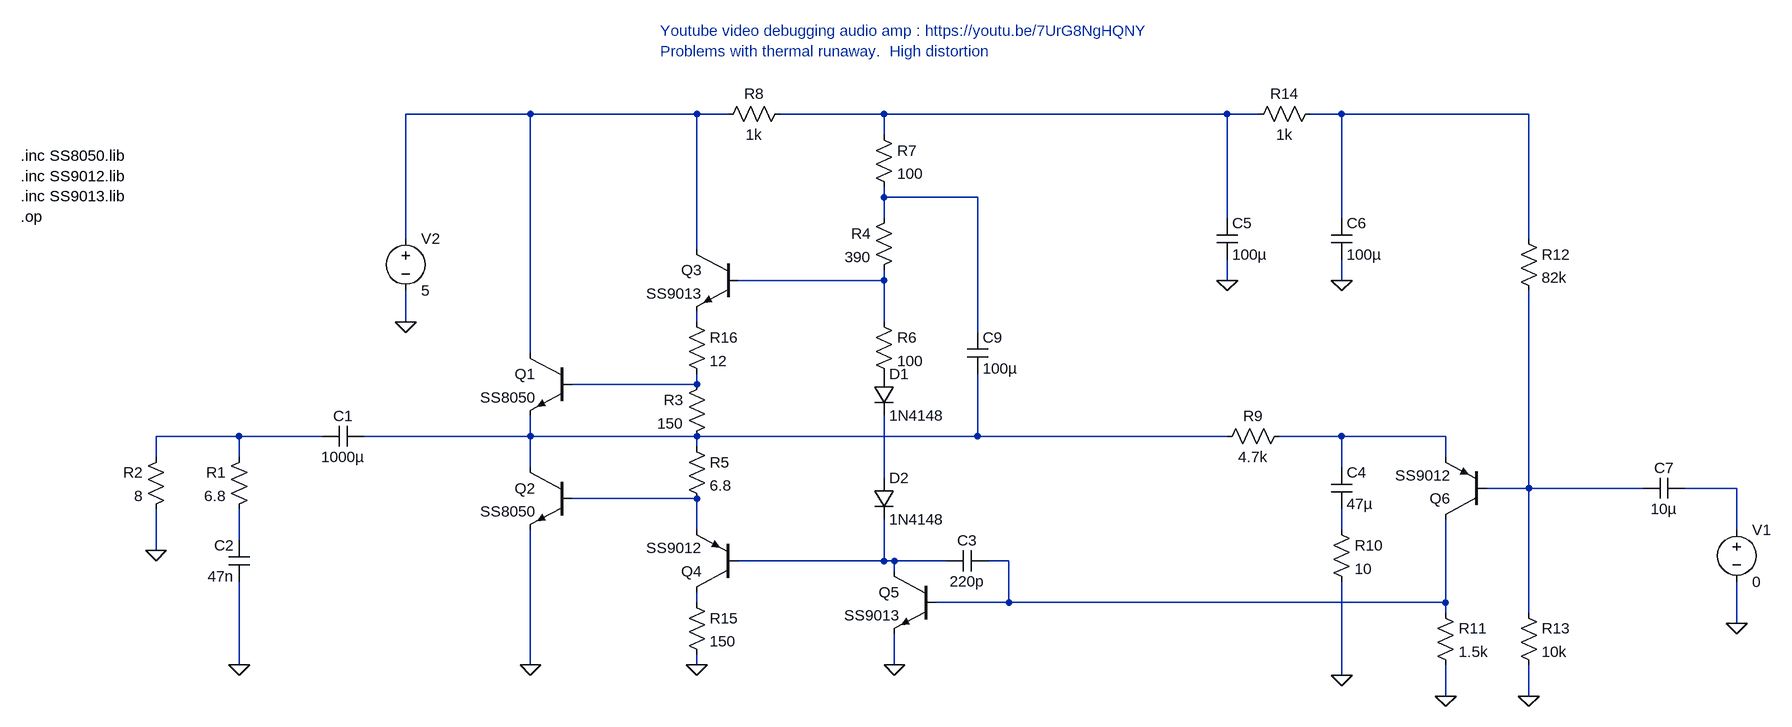
[diagram p0: schematic XTD-audio_amp.asc]
XTD-audio_amp.asc, the LTspice schematic file:
Version 4
SHEET 1 2280 680
WIRE 368 -336 176 -336
WIRE 624 -336 368 -336
WIRE 672 -336 624 -336
WIRE 912 -336 752 -336
WIRE 1440 -336 912 -336
WIRE 1488 -336 1440 -336
WIRE 1616 -336 1568 -336
WIRE 1904 -336 1616 -336
WIRE 912 -304 912 -336
WIRE 912 -208 912 -224
WIRE 1056 -208 912 -208
WIRE 912 -176 912 -208
WIRE 1440 -176 1440 -336
WIRE 1616 -176 1616 -336
WIRE 176 -144 176 -336
WIRE 1904 -144 1904 -336
WIRE 624 -128 624 -336
WIRE 912 -80 912 -96
WIRE 912 -80 688 -80
WIRE 1440 -80 1440 -112
WIRE 1616 -80 1616 -112
WIRE 176 -16 176 -64
WIRE 624 -16 624 -32
WIRE 912 -16 912 -80
WIRE 1056 0 1056 -208
WIRE 368 32 368 -336
WIRE 624 80 624 64
WIRE 624 80 432 80
WIRE -80 160 -208 160
WIRE 48 160 -80 160
WIRE 368 160 368 128
WIRE 368 160 112 160
WIRE 624 160 368 160
WIRE 1056 160 1056 64
WIRE 1056 160 624 160
WIRE 1440 160 1056 160
WIRE 1616 160 1520 160
WIRE 1776 160 1616 160
WIRE 624 176 624 160
WIRE -208 192 -208 160
WIRE -80 192 -80 160
WIRE 1776 192 1776 160
WIRE 368 208 368 160
WIRE 1616 208 1616 160
WIRE 912 224 912 128
WIRE 1904 240 1904 -64
WIRE 1904 240 1840 240
WIRE 2080 240 1904 240
WIRE 2224 240 2144 240
WIRE 624 256 432 256
WIRE 624 304 624 256
WIRE 1616 304 1616 272
WIRE 2224 304 2224 240
WIRE -80 320 -80 272
WIRE -208 336 -208 272
WIRE 912 352 912 288
WIRE 912 352 688 352
WIRE 928 352 912 352
WIRE 1008 352 928 352
WIRE 1104 352 1072 352
WIRE 928 368 928 352
WIRE 624 416 624 400
WIRE 1104 416 1104 352
WIRE 1104 416 992 416
WIRE 1776 416 1776 288
WIRE 1776 416 1104 416
WIRE 1776 432 1776 416
WIRE 1904 432 1904 240
WIRE 2224 448 2224 384
WIRE -80 512 -80 384
WIRE 368 512 368 304
WIRE 624 512 624 496
WIRE 928 512 928 464
WIRE 1616 528 1616 384
WIRE 1776 560 1776 512
WIRE 1904 560 1904 512
FLAG -208 336 0
FLAG -80 512 0
FLAG 624 512 0
FLAG 368 512 0
FLAG 928 512 0
FLAG 1616 528 0
FLAG 1776 560 0
FLAG 1440 -80 0
FLAG 1616 -80 0
FLAG 1904 560 0
FLAG 176 -16 0
FLAG 2224 448 0
DATAFLAG 192 160 ""
DATAFLAG 512 80 ""
DATAFLAG 512 256 ""
DATAFLAG 768 -80 ""
DATAFLAG 1040 -336 ""
DATAFLAG 1696 -336 ""
DATAFLAG 1696 160 ""
DATAFLAG 1536 416 ""
DATAFLAG 1984 240 ""
DATAFLAG 768 352 ""
SYMBOL npn 432 32 M0
SYMATTR InstName Q1
SYMATTR Value SS8050
SYMBOL npn 432 208 M0
SYMATTR InstName Q2
SYMATTR Value SS8050
SYMBOL cap 48 144 M90
WINDOW 0 0 32 VBottom 2
WINDOW 3 32 32 VTop 2
SYMATTR InstName C1
SYMATTR Value 1000µ
SYMBOL res -64 176 M0
SYMATTR InstName R1
SYMATTR Value 6.8
SYMBOL cap -64 320 M0
SYMATTR InstName C2
SYMATTR Value 47n
SYMBOL res -192 176 M0
SYMATTR InstName R2
SYMATTR Value 8
SYMBOL res 640 64 M0
SYMATTR InstName R3
SYMATTR Value 150
SYMBOL npn 688 -128 M0
SYMATTR InstName Q3
SYMATTR Value SS9013
SYMBOL res 928 -192 M0
SYMATTR InstName R4
SYMATTR Value 390
SYMBOL res 608 160 R0
SYMATTR InstName R5
SYMATTR Value 6.8
SYMBOL pnp 688 400 R180
SYMATTR InstName Q4
SYMATTR Value SS9012
SYMBOL res 896 -32 R0
SYMATTR InstName R6
SYMATTR Value 100
SYMBOL diode 896 64 R0
SYMATTR InstName D1
SYMATTR Value 1N4148
SYMBOL diode 896 224 R0
SYMATTR InstName D2
SYMATTR Value 1N4148
SYMBOL npn 992 368 M0
SYMATTR InstName Q5
SYMATTR Value SS9013
SYMBOL cap 1072 336 R90
WINDOW 0 0 32 VBottom 2
WINDOW 3 32 32 VTop 2
SYMATTR InstName C3
SYMATTR Value 220p
SYMBOL res 896 -320 R0
SYMATTR InstName R7
SYMATTR Value 100
SYMBOL res 768 -352 R90
WINDOW 0 0 56 VBottom 2
WINDOW 3 32 56 VTop 2
SYMATTR InstName R8
SYMATTR Value 1k
SYMBOL res 1536 144 R90
WINDOW 0 0 56 VBottom 2
WINDOW 3 32 56 VTop 2
SYMATTR InstName R9
SYMATTR Value 4.7k
SYMBOL cap 1600 208 R0
SYMATTR InstName C4
SYMATTR Value 47µ
SYMBOL res 1600 288 R0
SYMATTR InstName R10
SYMATTR Value 10
SYMBOL res 1760 416 R0
SYMATTR InstName R11
SYMATTR Value 1.5k
SYMBOL pnp 1840 288 R180
SYMATTR InstName Q6
SYMATTR Value SS9012
SYMBOL res 1888 -160 R0
SYMATTR InstName R12
SYMATTR Value 82k
SYMBOL res 1888 416 R0
SYMATTR InstName R13
SYMATTR Value 10k
SYMBOL cap 1424 -176 R0
SYMATTR InstName C5
SYMATTR Value 100µ
SYMBOL cap 1600 -176 R0
SYMATTR InstName C6
SYMATTR Value 100µ
SYMBOL res 1584 -352 R90
WINDOW 0 0 56 VBottom 2
WINDOW 3 32 56 VTop 2
SYMATTR InstName R14
SYMATTR Value 1k
SYMBOL cap 2144 224 R90
WINDOW 0 0 32 VBottom 2
WINDOW 3 32 32 VTop 2
SYMATTR InstName C7
SYMATTR Value 10µ
SYMBOL cap 1040 0 R0
SYMATTR InstName C9
SYMATTR Value 100µ
SYMBOL voltage 2224 288 R0
SYMATTR InstName V1
SYMATTR Value 0
SYMBOL voltage 176 -160 R0
SYMATTR InstName V2
SYMATTR Value 5
SYMBOL res 608 400 R0
SYMATTR InstName R15
SYMATTR Value 150
SYMBOL res 608 -32 R0
SYMATTR InstName R16
SYMATTR Value 12
TEXT -416 -272 Left 2 !.inc SS8050.lib\n.inc SS9012.lib\n.inc SS9013.lib\n.op
TEXT 568 -464 Left 2 ;Youtube video debugging audio amp : https://youtu.be/7UrG8NgHQNY\nProblems with thermal runaway.  High distortion

The netlist it stands for:
* XTD-audio_amp.asc
Q1 N001 N007 N009 0 SS8050
Q2 N009 N014 0 0 SS8050
C1 N008 N009 1000µ
R1 N008 N016 6.8
C2 N016 0 47n
R2 N008 0 8
R3 N007 N009 150
Q3 N001 N005 N006 0 SS9013
R4 N004 N005 390
R5 N009 N014 6.8
Q4 N019 N017 N014 0 SS9012
R6 N005 P001 100
D1 P001 N011 1N4148
D2 N011 N017 1N4148
Q5 N017 N018 0 0 SS9013
C3 N018 N017 220p
R7 N002 N004 100
R8 N002 N001 1k
R9 N010 N009 4.7k
C4 N010 N015 47µ
R10 N015 0 10
R11 N018 0 1.5k
Q6 N018 N012 N010 0 SS9012
R12 N003 N012 82k
R13 N012 0 10k
C5 N002 0 100µ
C6 N003 0 100µ
R14 N003 N002 1k
C7 N013 N012 10µ
C9 N004 N009 100µ
V1 N013 0 0
V2 N001 0 5
R15 N019 0 150
R16 N006 N007 12
.model D D
.lib standard.dio
.model NPN NPN
.model PNP PNP
.lib standard.bjt
.inc SS8050.lib
.inc SS9012.lib
.inc SS9013.lib
.op
* Youtube video debugging audio amp : https://youtu.be/7UrG8NgHQNY
* Problems with thermal runaway.  High distortion
.backanno
.end